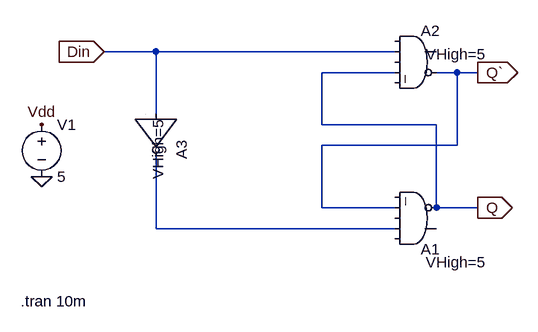
[diagram p0: schematic SR_Latch.asc]
SR_Latch.asc, the LTspice schematic file:
Version 4
SHEET 1 880 680
WIRE 0 208 -80 208
WIRE 368 208 0 208
WIRE 368 240 256 240
WIRE 464 240 432 240
WIRE 496 240 464 240
WIRE 0 304 0 208
WIRE 256 320 256 240
WIRE 432 320 256 320
WIRE 464 352 464 240
WIRE 464 352 256 352
WIRE 256 448 256 352
WIRE 368 448 256 448
WIRE 432 448 432 320
WIRE 496 448 432 448
WIRE 0 480 0 368
WIRE 368 480 0 480
FLAG -176 400 0
FLAG -176 320 Vdd
FLAG -80 208 Din
IOPIN -80 208 In
FLAG 496 240 Q`
IOPIN 496 240 Out
FLAG 496 448 Q
IOPIN 496 448 Out
SYMBOL voltage -176 304 R0
WINDOW 123 0 0 Left 0
WINDOW 39 0 0 Left 0
SYMATTR InstName V1
SYMATTR Value 5
SYMBOL Digital\\and 400 160 R0
WINDOW 123 16 52 Left 2
SYMATTR InstName A2
SYMATTR Value2 VHigh=5
SYMBOL Digital\\and 400 528 M180
WINDOW 123 16 -4 Left 2
SYMATTR InstName A1
SYMATTR Value2 VHigh=5
SYMBOL Digital\\inv 64 304 R90
WINDOW 123 8 60 Left 2
SYMATTR InstName A3
SYMATTR Value2 VHigh=5
TEXT -208 592 Left 2 !.tran 10m

The netlist it stands for:
* SR_Latch.asc
V1 Vdd 0 5
A2 0 Din 0 Q 0 Q` 0 0 AND VHigh=5
A1 0 N001 0 Q` 0 Q 0 0 AND VHigh=5
A3 Din 0 0 0 0 N001 0 0 BUF VHigh=5
.tran 10m
.backanno
.end